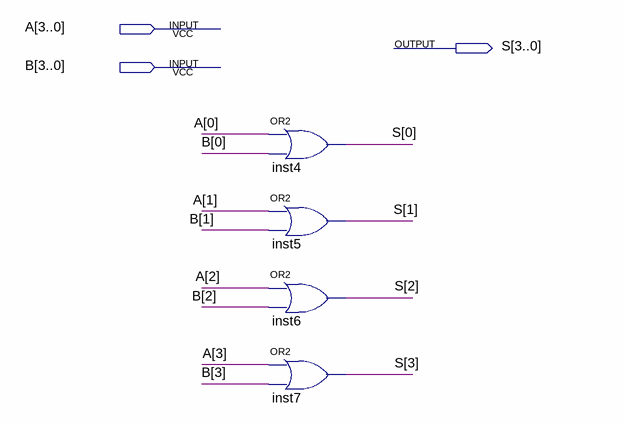
[diagram p0: schematic sheet]
// Quartus schematic OR_4_BITS.bdf as structural Verilog: 4 symbols, 3 pins
module OR_4_BITS (
  input  [3:0] A,
  input  [3:0] B,
  output [3:0] S
);

  or inst4 (S[0], A[0], B[0]);
  or inst5 (S[1], A[1], B[1]);
  or inst6 (S[2], A[2], B[2]);
  or inst7 (S[3], A[3], B[3]);
endmodule
